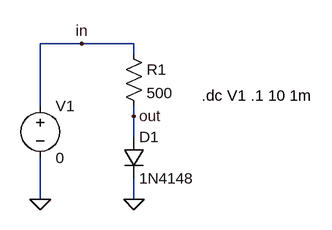
[diagram p0: schematic 1n4148_test.asc]
1n4148_test.asc, the LTspice schematic file:
Version 4
SHEET 1 880 680
WIRE 112 48 48 48
WIRE 192 48 112 48
WIRE 192 64 192 48
WIRE 48 144 48 48
WIRE 192 160 192 144
WIRE 192 192 192 160
WIRE 48 288 48 224
WIRE 192 288 192 256
FLAG 192 288 0
FLAG 48 288 0
FLAG 112 48 in
FLAG 192 160 out
SYMBOL res 176 48 R0
SYMATTR InstName R1
SYMATTR Value 500
SYMBOL diode 176 192 R0
SYMATTR InstName D1
SYMATTR Value 1N4148
SYMBOL voltage 48 128 R0
WINDOW 123 0 0 Left 0
WINDOW 39 0 0 Left 0
SYMATTR InstName V1
SYMATTR Value 0
TEXT 296 128 Left 2 !.dc V1 .1 10 1m

The netlist it stands for:
* 1n4148_test.asc
R1 in out 500
D1 out 0 1N4148
V1 in 0 0
.model D D
.lib standard.dio
.dc V1 .1 10 1m
.backanno
.end